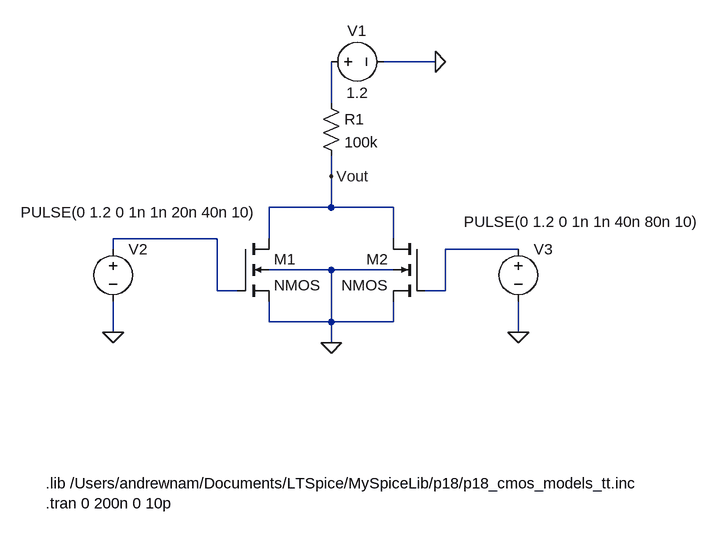
[diagram p0: schematic fig06_nor.asc]
fig06_nor.asc, the LTspice schematic file:
Version 4
SHEET 1 1120 732
WIRE 608 48 528 48
WIRE 448 112 448 48
WIRE 448 224 448 192
WIRE 448 272 448 224
WIRE 448 272 352 272
WIRE 544 272 448 272
WIRE 272 320 112 320
WIRE 352 320 352 272
WIRE 544 320 544 272
WIRE 112 336 112 320
WIRE 736 336 624 336
WIRE 448 368 352 368
WIRE 544 368 448 368
WIRE 272 400 272 320
WIRE 304 400 272 400
WIRE 624 400 624 336
WIRE 624 400 592 400
WIRE 352 448 352 416
WIRE 448 448 448 368
WIRE 448 448 352 448
WIRE 544 448 544 416
WIRE 544 448 448 448
WIRE 112 464 112 416
WIRE 736 464 736 416
WIRE 448 480 448 448
FLAG 448 480 0
FLAG 608 48 0
FLAG 736 464 0
FLAG 112 464 0
FLAG 448 224 Vout
SYMBOL voltage 432 48 R270
WINDOW 0 32 56 VTop 2
WINDOW 3 -32 56 VBottom 2
SYMATTR InstName V1
SYMATTR Value 1.2
SYMBOL voltage 112 320 R0
WINDOW 3 -142 -41 Left 2
SYMATTR InstName V2
SYMATTR Value PULSE(0 1.2 0 1n 1n 20n 40n 10)
SYMBOL voltage 736 320 R0
WINDOW 3 -84 -26 Left 2
SYMATTR InstName V3
SYMATTR Value PULSE(0 1.2 0 1n 1n 40n 80n 10)
SYMBOL nmos4 304 320 R0
SYMATTR InstName M1
SYMATTR Value2 l=0.18u w=10u
SYMBOL nmos4 592 320 M0
SYMATTR InstName M2
SYMATTR Value2 l=0.18u w=10u
SYMBOL res 432 96 R0
SYMATTR InstName R1
SYMATTR Value 100k
TEXT 8 696 Left 2 !.lib /Users/andrewnam/Documents/LTSpice/MySpiceLib/p18/p18_cmos_models_tt.inc\n.tran 0 200n 0 10p

The netlist it stands for:
* fig06_nor.asc
V1 N001 0 1.2
V2 N002 0 PULSE(0 1.2 0 1n 1n 20n 40n 10)
V3 N003 0 PULSE(0 1.2 0 1n 1n 40n 80n 10)
M1 Vout N002 0 0 NMOS l=0.18u w=10u
M2 Vout N003 0 0 NMOS l=0.18u w=10u
R1 N001 Vout 100k
.model NMOS NMOS
.model PMOS PMOS
.lib standard.mos
.lib /Users/andrewnam/Documents/LTSpice/MySpiceLib/p18/p18_cmos_models_tt.inc
.tran 0 200n 0 10p
.backanno
.end